# Altium schematic sheet Ch3and4.SchDoc
size A
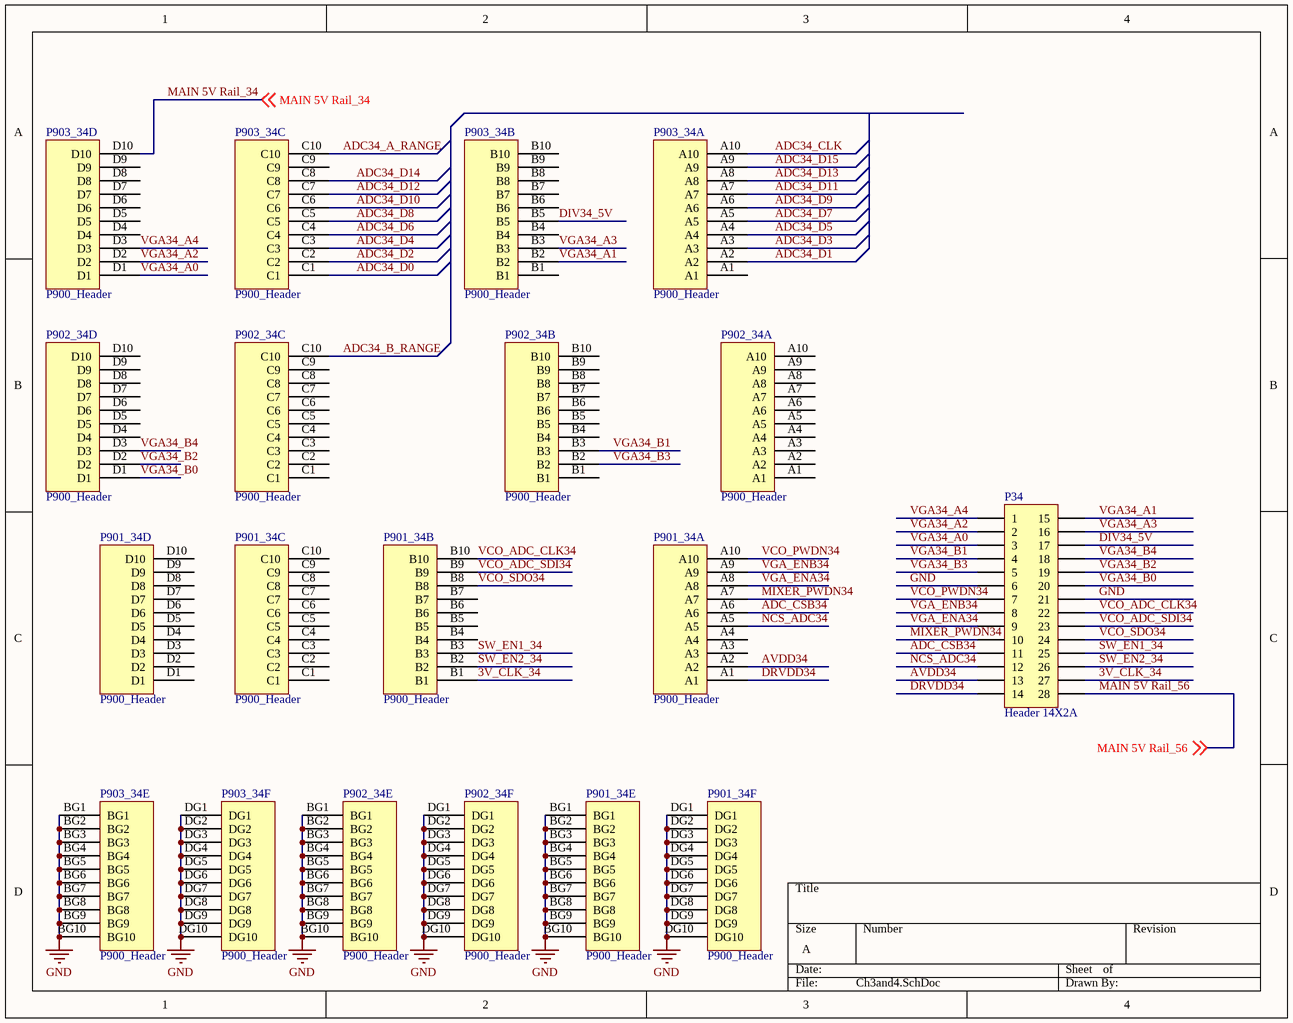
[diagram p0: Ch3and4.SchDoc]

## Parts
P34  Header 14X2A  [HDR2X14_CEN]
P901_34  P900_Header  [P900_header]  (parts A,B,C,D,E,F of 6)
P902_34  P900_Header  [P900_header]  (parts A,B,C,D,E,F of 6)
P903_34  P900_Header  [P900_header]  (parts A,B,C,D,E,F of 6)

## Nets
GND: P34.6 P34.21 P901_34.BG1 P901_34.BG2 P901_34.BG3 P901_34.BG4 P901_34.BG5 P901_34.BG6 P901_34.BG7 P901_34.BG8 P901_34.BG9 P901_34.BG10 P901_34.DG1 P901_34.DG2 P901_34.DG3 P901_34.DG4 P901_34.DG5 P901_34.DG6 P901_34.DG7 P901_34.DG8 P901_34.DG9 P901_34.DG10 P902_34.BG1 P902_34.BG2 P902_34.BG3 P902_34.BG4 P902_34.BG5 P902_34.BG6 P902_34.BG7 P902_34.BG8 P902_34.BG9 P902_34.BG10 P902_34.DG1 P902_34.DG2 P902_34.DG3 P902_34.DG4 P902_34.DG5 P902_34.DG6 P902_34.DG7 P902_34.DG8 P902_34.DG9 P902_34.DG10 P903_34.BG1 P903_34.BG2 P903_34.BG3 P903_34.BG4 P903_34.BG5 P903_34.BG6 P903_34.BG7 P903_34.BG8 P903_34.BG9 P903_34.BG10 P903_34.DG1 P903_34.DG2 P903_34.DG3 P903_34.DG4 P903_34.DG5 P903_34.DG6 P903_34.DG7 P903_34.DG8 P903_34.DG9 P903_34.DG10
3V_CLK_34: P34.27 P901_34.B1
ADC34_A_RANGE: P903_34.C10
ADC34_B_RANGE: P902_34.C10
ADC34_CLK: P903_34.A10
ADC34_D0: P903_34.C1
ADC34_D1: P903_34.A2
ADC34_D2: P903_34.C2
ADC34_D3: P903_34.A3
ADC34_D4: P903_34.C3
ADC34_D5: P903_34.A4
ADC34_D6: P903_34.C4
ADC34_D7: P903_34.A5
ADC34_D8: P903_34.C5
ADC34_D9: P903_34.A6
ADC34_D10: P903_34.C6
ADC34_D11: P903_34.A7
ADC34_D12: P903_34.C7
ADC34_D13: P903_34.A8
ADC34_D14: P903_34.C8
ADC34_D15: P903_34.A9
ADC_CSB34: P34.11 P901_34.A6
AVDD34: P34.13 P901_34.A2
DIV34_5V: P34.17 P903_34.B5
DRVDD34: P34.14 P901_34.A1
MAIN 5V Rail_34: P903_34.D10 ; off-sheet MAIN 5V Rail_34
MAIN 5V Rail_56: P34.28 ; off-sheet MAIN 5V Rail_56
MIXER_PWDN34: P34.10 P901_34.A7
NCS_ADC34: P34.12 P901_34.A5
SW_EN1_34: P34.25 P901_34.B3
SW_EN2_34: P34.26 P901_34.B2
VCO_ADC_CLK34: P34.22 P901_34.B10
VCO_ADC_SDI34: P34.23 P901_34.B9
VCO_PWDN34: P34.7 P901_34.A10
VCO_SDO34: P34.24 P901_34.B8
VGA34_A0: P34.3 P903_34.D1
VGA34_A1: P34.15 P903_34.B2
VGA34_A2: P34.2 P903_34.D2
VGA34_A3: P34.16 P903_34.B3
VGA34_A4: P34.1 P903_34.D3
VGA34_B0: P34.20 P902_34.D1
VGA34_B1: P34.4 P902_34.B3
VGA34_B2: P34.19 P902_34.D2
VGA34_B3: P34.5 P902_34.B2
VGA34_B4: P34.18 P902_34.D3
VGA_ENA34: P34.9 P901_34.A8
VGA_ENB34: P34.8 P901_34.A9

Not connected (* = marked no-connect by the designer): P901_34 A3 A4 B4 B5 B6 B7 C1 C2 C3 C4 C5 C6 C7 C8 C9 C10 D1 D2 D3 D4 D5 D6 D7 D8 D9 D10; P902_34 A1 A2 A3 A4 A5 A6 A7 A8 A9 A10 B1 B4 B5 B6 B7 B8 B9 B10 C1 C2 C3 C4 C5 C6 C7 C8 C9 D4 D5 D6 D7 D8 D9 D10; P903_34 A1 B1 B4 B6 B7 B8 B9 B10 C9 D4 D5 D6 D7 D8 D9

## Library data of the parts
P34 = Header 14X2A: Header, 14-Pin, Dual row; LatestRevisionDate: 17-Jul-2002; LatestRevisionNote: Re-released for DXP Platform.; Publisher: Altium Limited
P902_34 P903_34 = P900_Header: pin to pad: A1>ADC